# EAGLE design zumo_uni_spi_01 (EAGLE 9.5.2)
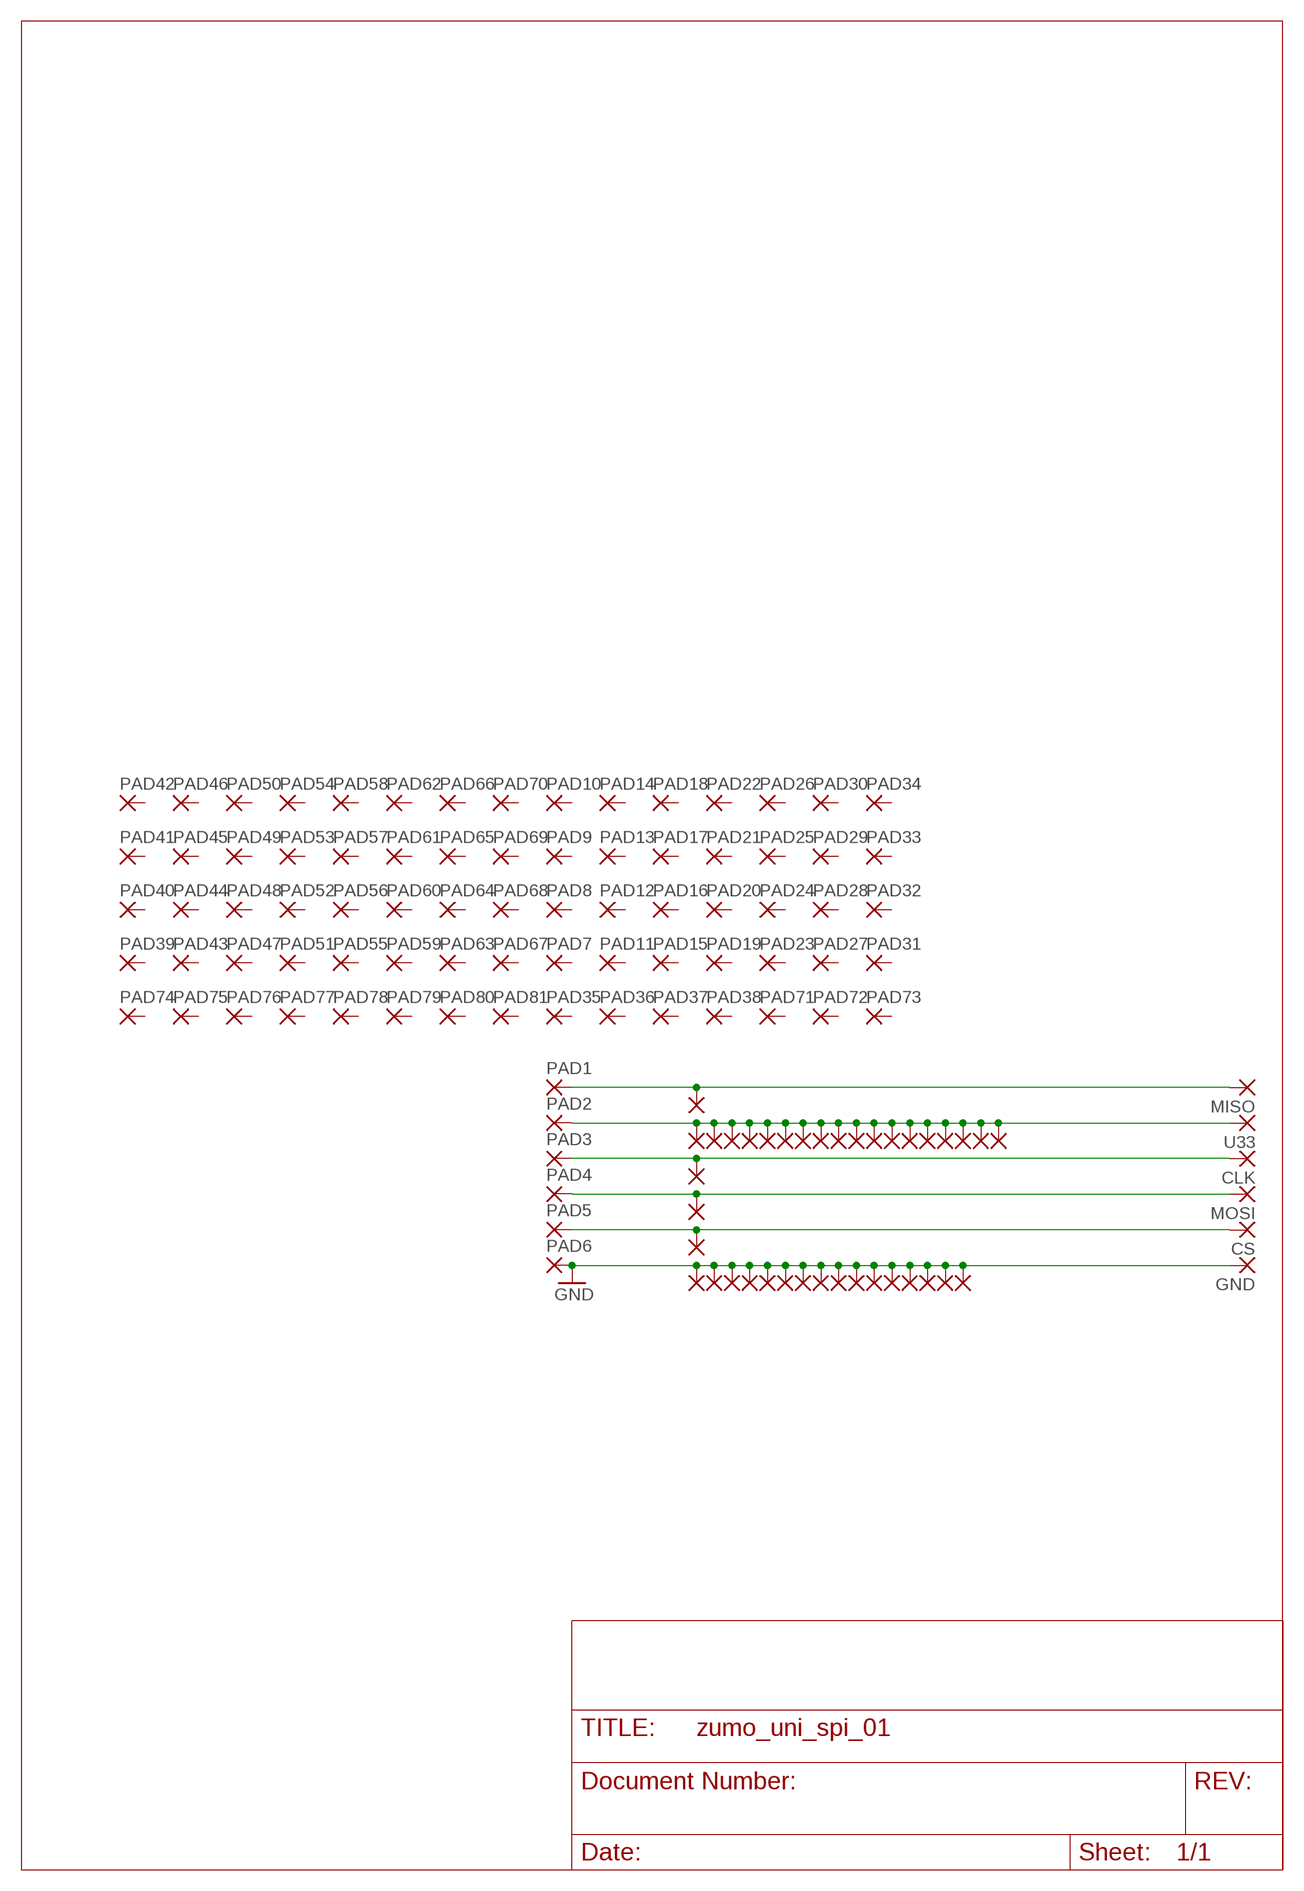
[diagram p0: schematic, sheet 1]

## Parts
CLK  1,6/0,9  [1,6/0,9]
CS  1,6/0,9  [1,6/0,9]
GND  1,6/0,9  [1,6/0,9]
MISO  1,6/0,9  [1,6/0,9]
MISO1  1,6/0,9  [1,6/0,9]
MISO2  1,6/0,9  [1,6/0,9]
MISO3  1,6/0,9  [1,6/0,9]
MISO4  1,6/0,9  [1,6/0,9]
MISO5  1,6/0,9  [1,6/0,9]
MISO6  1,6/0,9  [1,6/0,9]
MISO7  1,6/0,9  [1,6/0,9]
MISO8  1,6/0,9  [1,6/0,9]
MISO9  1,6/0,9  [1,6/0,9]
MISO10  1,6/0,9  [1,6/0,9]
MISO11  1,6/0,9  [1,6/0,9]
MISO12  1,6/0,9  [1,6/0,9]
MISO13  1,6/0,9  [1,6/0,9]
MISO14  1,6/0,9  [1,6/0,9]
MISO15  1,6/0,9  [1,6/0,9]
MISO16  1,6/0,9  [1,6/0,9]
MISO17  1,6/0,9  [1,6/0,9]
MISO18  1,6/0,9  [1,6/0,9]
MISO19  1,6/0,9  [1,6/0,9]
MISO20  1,6/0,9  [1,6/0,9]
MISO21  1,6/0,9  [1,6/0,9]
MISO22  1,6/0,9  [1,6/0,9]
MISO23  1,6/0,9  [1,6/0,9]
MISO24  1,6/0,9  [1,6/0,9]
MISO25  1,6/0,9  [1,6/0,9]
MISO26  1,6/0,9  [1,6/0,9]
MISO27  1,6/0,9  [1,6/0,9]
MISO28  1,6/0,9  [1,6/0,9]
MISO29  1,6/0,9  [1,6/0,9]
MISO30  1,6/0,9  [1,6/0,9]
MISO31  1,6/0,9  [1,6/0,9]
MISO32  1,6/0,9  [1,6/0,9]
MISO33  1,6/0,9  [1,6/0,9]
MISO34  1,6/0,9  [1,6/0,9]
MISO35  1,6/0,9  [1,6/0,9]
MISO36  1,6/0,9  [1,6/0,9]
MISO37  1,6/0,9  [1,6/0,9]
MISO38  1,6/0,9  [1,6/0,9]
MOSI  1,6/0,9  [1,6/0,9]
PAD1  SMD2  [SMD1,27-2,54]
PAD2  SMD2  [SMD1,27-2,54]
PAD3  SMD2  [SMD1,27-2,54]
PAD4  SMD2  [SMD1,27-2,54]
PAD5  SMD2  [SMD1,27-2,54]
PAD6  SMD2  [SMD1,27-2,54]
PAD7  1,6/0,9  [1,6/0,9]
PAD8  1,6/0,9  [1,6/0,9]
PAD9  1,6/0,9  [1,6/0,9]
PAD10  1,6/0,9  [1,6/0,9]
PAD11  1,6/0,9  [1,6/0,9]
PAD12  1,6/0,9  [1,6/0,9]
PAD13  1,6/0,9  [1,6/0,9]
PAD14  1,6/0,9  [1,6/0,9]
PAD15  1,6/0,9  [1,6/0,9]
PAD16  1,6/0,9  [1,6/0,9]
PAD17  1,6/0,9  [1,6/0,9]
PAD18  1,6/0,9  [1,6/0,9]
PAD19  1,6/0,9  [1,6/0,9]
PAD20  1,6/0,9  [1,6/0,9]
PAD21  1,6/0,9  [1,6/0,9]
PAD22  1,6/0,9  [1,6/0,9]
PAD23  1,6/0,9  [1,6/0,9]
PAD24  1,6/0,9  [1,6/0,9]
PAD25  1,6/0,9  [1,6/0,9]
PAD26  1,6/0,9  [1,6/0,9]
PAD27  1,6/0,9  [1,6/0,9]
PAD28  1,6/0,9  [1,6/0,9]
PAD29  1,6/0,9  [1,6/0,9]
PAD30  1,6/0,9  [1,6/0,9]
PAD31  1,6/0,9  [1,6/0,9]
PAD32  1,6/0,9  [1,6/0,9]
PAD33  1,6/0,9  [1,6/0,9]
PAD34  1,6/0,9  [1,6/0,9]
PAD35  1,6/0,9  [1,6/0,9]
PAD36  1,6/0,9  [1,6/0,9]
PAD37  1,6/0,9  [1,6/0,9]
PAD38  1,6/0,9  [1,6/0,9]
PAD39  1,6/0,9  [1,6/0,9]
PAD40  1,6/0,9  [1,6/0,9]
PAD41  1,6/0,9  [1,6/0,9]
PAD42  1,6/0,9  [1,6/0,9]
PAD43  1,6/0,9  [1,6/0,9]
PAD44  1,6/0,9  [1,6/0,9]
PAD45  1,6/0,9  [1,6/0,9]
PAD46  1,6/0,9  [1,6/0,9]
PAD47  1,6/0,9  [1,6/0,9]
PAD48  1,6/0,9  [1,6/0,9]
PAD49  1,6/0,9  [1,6/0,9]
PAD50  1,6/0,9  [1,6/0,9]
PAD51  1,6/0,9  [1,6/0,9]
PAD52  1,6/0,9  [1,6/0,9]
PAD53  1,6/0,9  [1,6/0,9]
PAD54  1,6/0,9  [1,6/0,9]
PAD55  1,6/0,9  [1,6/0,9]
PAD56  1,6/0,9  [1,6/0,9]
PAD57  1,6/0,9  [1,6/0,9]
PAD58  1,6/0,9  [1,6/0,9]
PAD59  1,6/0,9  [1,6/0,9]
PAD60  1,6/0,9  [1,6/0,9]
PAD61  1,6/0,9  [1,6/0,9]
PAD62  1,6/0,9  [1,6/0,9]
PAD63  1,6/0,9  [1,6/0,9]
PAD64  1,6/0,9  [1,6/0,9]
PAD65  1,6/0,9  [1,6/0,9]
PAD66  1,6/0,9  [1,6/0,9]
PAD67  1,6/0,9  [1,6/0,9]
PAD68  1,6/0,9  [1,6/0,9]
PAD69  1,6/0,9  [1,6/0,9]
PAD70  1,6/0,9  [1,6/0,9]
PAD71  1,6/0,9  [1,6/0,9]
PAD72  1,6/0,9  [1,6/0,9]
PAD73  1,6/0,9  [1,6/0,9]
PAD74  1,6/0,9  [1,6/0,9]
PAD75  1,6/0,9  [1,6/0,9]
PAD76  1,6/0,9  [1,6/0,9]
PAD77  1,6/0,9  [1,6/0,9]
PAD78  1,6/0,9  [1,6/0,9]
PAD79  1,6/0,9  [1,6/0,9]
PAD80  1,6/0,9  [1,6/0,9]
PAD81  1,6/0,9  [1,6/0,9]
U33  1,6/0,9  [1,6/0,9]

## Nets
GND [gnd]: GND.1(P) MISO5.1(P) MISO6.1(P) MISO7.1(P) MISO8.1(P) MISO9.1(P) MISO10.1(P) MISO11.1(P) MISO12.1(P) MISO13.1(P) MISO14.1(P) MISO15.1(P) MISO16.1(P) MISO17.1(P) MISO18.1(P) MISO19.1(P) MISO20.1(P) PAD6.1(P)
SPI_CLK: CLK.1(P) MISO3.1(P) PAD3.1(P)
SPI_CS: CS.1(P) MISO1.1(P) PAD5.1(P)
SPI_MISO: MISO21.1(P) MISO.1(P) PAD1.1(P)
SPI_MOSI: MISO2.1(P) MOSI.1(P) PAD4.1(P)
U3.3 [power]: MISO4.1(P) MISO22.1(P) MISO23.1(P) MISO24.1(P) MISO25.1(P) MISO26.1(P) MISO27.1(P) MISO28.1(P) MISO29.1(P) MISO30.1(P) MISO31.1(P) MISO32.1(P) MISO33.1(P) MISO34.1(P) MISO35.1(P) MISO36.1(P) MISO37.1(P) MISO38.1(P) PAD2.1(P) U33.1(P)
Unconnected: PAD7.1(P) PAD8.1(P) PAD9.1(P) PAD10.1(P) PAD11.1(P) PAD12.1(P) PAD13.1(P) PAD14.1(P) PAD15.1(P) PAD16.1(P) PAD17.1(P) PAD18.1(P) PAD19.1(P) PAD20.1(P) PAD21.1(P) PAD22.1(P) PAD23.1(P) PAD24.1(P) PAD25.1(P) PAD26.1(P) PAD27.1(P) PAD28.1(P) PAD29.1(P) PAD30.1(P) PAD31.1(P) PAD32.1(P) PAD33.1(P) PAD34.1(P) PAD35.1(P) PAD36.1(P) PAD37.1(P) PAD38.1(P) PAD39.1(P) PAD40.1(P) PAD41.1(P) PAD42.1(P) PAD43.1(P) PAD44.1(P) PAD45.1(P) PAD46.1(P) PAD47.1(P) PAD48.1(P) PAD49.1(P) PAD50.1(P) PAD51.1(P) PAD52.1(P) PAD53.1(P) PAD54.1(P) PAD55.1(P) PAD56.1(P) PAD57.1(P) PAD58.1(P) PAD59.1(P) PAD60.1(P) PAD61.1(P) PAD62.1(P) PAD63.1(P) PAD64.1(P) PAD65.1(P) PAD66.1(P) PAD67.1(P) PAD68.1(P) PAD69.1(P) PAD70.1(P) PAD71.1(P) PAD72.1(P) PAD73.1(P) PAD74.1(P) PAD75.1(P) PAD76.1(P) PAD77.1(P) PAD78.1(P) PAD79.1(P) PAD80.1(P) PAD81.1(P)

## Library data of the parts
CLK CS GND MISO MISO1-MISO38 MOSI PAD7-PAD81 U33 = wirepad:1,6/0,9: THROUGH-HOLE PAD
PAD1-PAD6 = wirepad:SMD2: SMD PAD

## Net classes
1 gnd: width 0.381 mm, drill 0.381 mm
2 power: width 0.381 mm, drill 0.381 mm

## Board
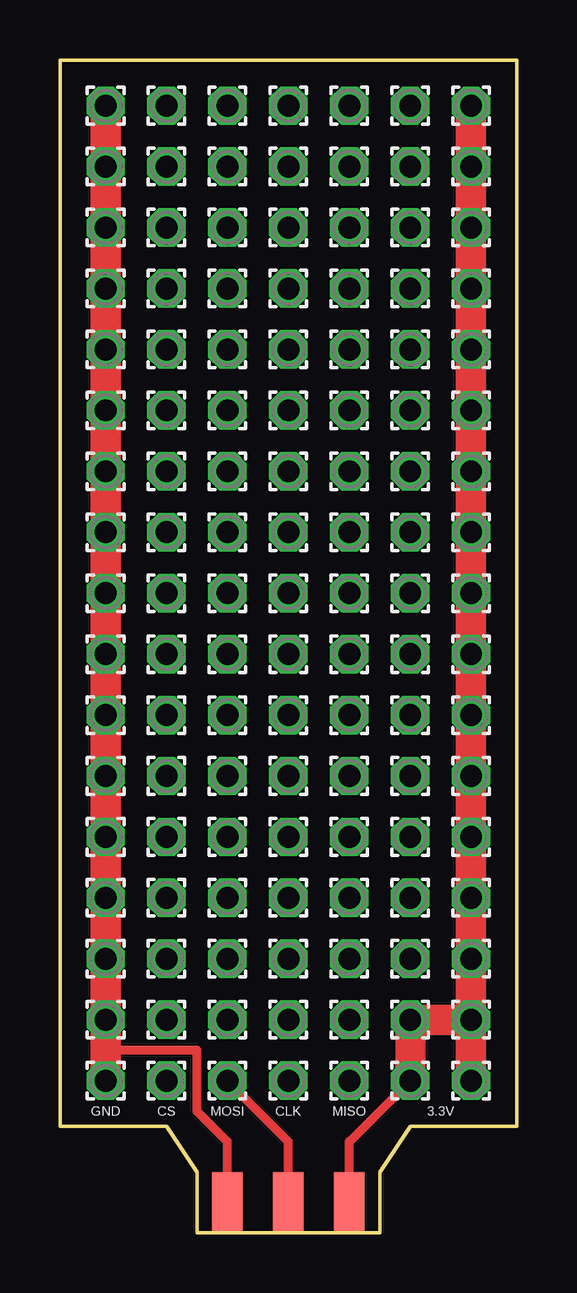
[diagram p1: board, top side]
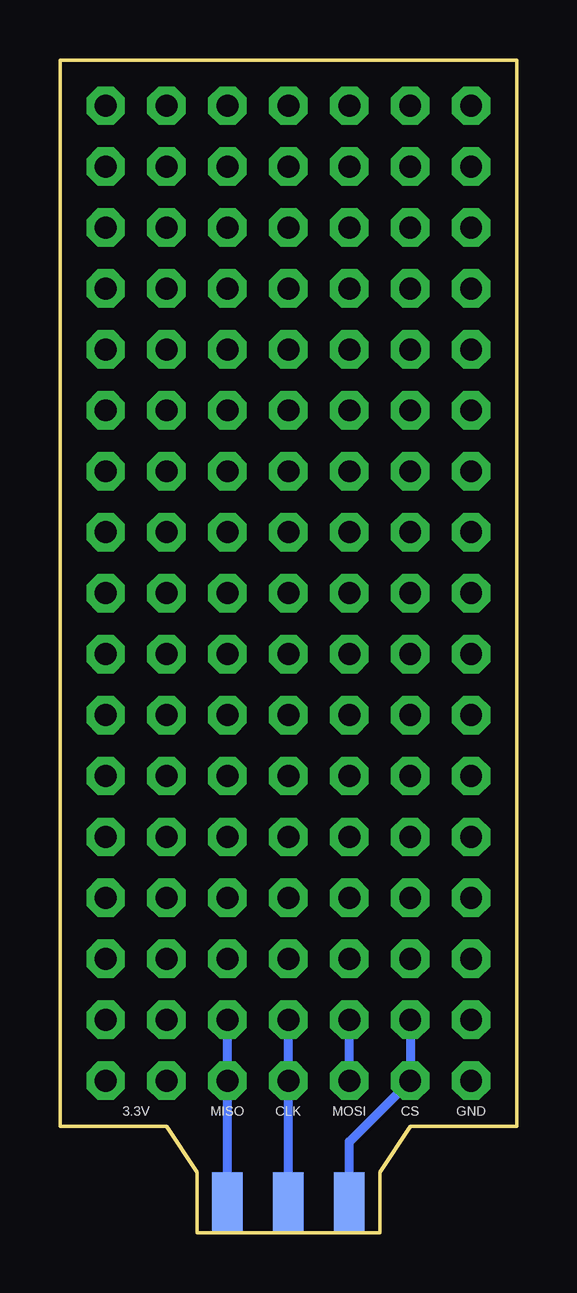
[diagram p2: board, bottom side, seen from below]

Size 19.05 x 48.9 mm. Coordinates in mm from the lower left corner, seen from the top.
Outline: 5.71,0 5.71,2.54 4.45,4.45 0,4.45 0,48.9 19.05,48.9 19.05,4.45 14.61,4.45 13.34,2.54 13.34,0 5.71,0
Copper layers (1*16): Top 0.035mm / dielectric 1.5mm / Bottom 0.035mm
Design rules "default": minimum track width 6mil, minimum drill 0.35mm, track to track 6mil, track to pad 6mil, pad to pad 6mil, via to via 6mil, smd to smd 6mil, copper to edge 40mil, drill to drill 6mil, minimum pad ring 10mil, minimum via ring 8mil, stop-mask expansion 4mil, vias tented up to drill 0mil, thermal gap 10mil

### Footprints (pad centres in the part's own frame; a part is rotated, then mirrored left to right if it is on the bottom)
1,6/0,9 = drill 0.914 pad 1.6 octagon: 1 0,0
SMD1,27-2,54 = smd 1.27 x 2.54: 1 0,0

### Placement (x,y rotation side)
CLK  9.53,6.35 0 top
CS  4.45,6.35 0 top
GND  1.91,6.35 0 top
MISO  12.06,6.35 0 top
MISO1  4.45,8.89 0 top
MISO2  6.99,8.89 0 top
MISO3  9.53,8.89 0 top
MISO4  17.14,8.89 0 top
MISO5  1.91,21.59 0 top
MISO6  1.91,26.67 0 top
MISO7  1.91,16.51 0 top
MISO8  1.91,24.13 0 top
MISO9  1.91,31.75 0 top
MISO10  1.91,29.21 0 top
MISO11  1.91,34.29 0 top
MISO12  1.91,39.37 0 top
MISO13  1.91,44.45 0 top
MISO14  1.91,41.91 0 top
MISO15  1.91,46.99 0 top
MISO16  1.91,19.05 0 top
MISO17  1.91,13.97 0 top
MISO18  1.91,11.43 0 top
MISO19  1.91,8.89 0 top
MISO20  1.91,36.83 0 top
MISO21  12.06,8.89 0 top
MISO22  17.14,11.43 0 top
MISO23  17.14,13.97 0 top
MISO24  17.14,16.51 0 top
MISO25  17.14,19.05 0 top
MISO26  17.14,21.59 0 top
MISO27  17.14,24.13 0 top
MISO28  17.14,26.67 0 top
MISO29  17.14,29.21 0 top
MISO30  17.14,31.75 0 top
MISO31  17.14,34.29 0 top
MISO32  17.14,36.83 0 top
MISO33  17.14,39.37 0 top
MISO34  17.14,41.91 0 top
MISO35  17.14,44.45 0 top
MISO36  17.14,46.99 0 top
MISO37  14.61,6.35 0 top
MISO38  14.61,8.89 0 top
MOSI  6.99,6.35 0 top
PAD1  12.06,1.27 0 bottom
PAD2  12.06,1.27 0 top
PAD3  9.53,1.27 0 bottom
PAD4  9.53,1.27 0 top
PAD5  6.99,1.27 0 bottom
PAD6  6.99,1.27 0 top
PAD7  4.45,11.43 0 top
PAD8  6.99,11.43 0 top
PAD9  9.53,11.43 0 top
PAD10  12.06,11.43 0 top
PAD11  12.06,13.97 0 top
PAD12  4.45,13.97 0 top
PAD13  6.99,13.97 0 top
PAD14  9.53,13.97 0 top
PAD15  4.45,16.51 0 top
PAD16  6.99,16.51 0 top
PAD17  9.53,16.51 0 top
PAD18  12.06,16.51 0 top
PAD19  4.45,19.05 0 top
PAD20  6.99,19.05 0 top
PAD21  12.06,19.05 0 top
PAD22  9.53,19.05 0 top
PAD23  4.45,21.59 0 top
PAD24  6.99,21.59 0 top
PAD25  9.53,21.59 0 top
PAD26  12.06,21.59 0 top
PAD27  4.45,24.13 0 top
PAD28  6.99,24.13 0 top
PAD29  9.53,24.13 0 top
PAD30  12.06,24.13 0 top
PAD31  4.45,26.67 0 top
PAD32  6.99,26.67 0 top
PAD33  9.53,26.67 0 top
PAD34  12.06,26.67 0 top
PAD35  14.61,11.43 0 top
PAD36  14.61,16.51 0 top
PAD37  14.61,19.05 0 top
PAD38  14.61,13.97 0 top
PAD39  4.45,29.21 0 top
PAD40  6.99,29.21 0 top
PAD41  9.53,29.21 0 top
PAD42  12.06,29.21 0 top
PAD43  4.45,31.75 0 top
PAD44  6.99,31.75 0 top
PAD45  9.53,31.75 0 top
PAD46  12.06,31.75 0 top
PAD47  4.45,34.29 0 top
PAD48  6.99,34.29 0 top
PAD49  9.53,34.29 0 top
PAD50  12.06,34.29 0 top
PAD51  4.45,36.83 0 top
PAD52  6.99,36.83 0 top
PAD53  9.53,36.83 0 top
PAD54  12.06,36.83 0 top
PAD55  4.45,39.37 0 top
PAD56  6.99,39.37 0 top
PAD57  12.06,39.37 0 top
PAD58  4.45,41.91 0 top
PAD59  9.53,39.37 0 top
PAD60  6.99,41.91 0 top
PAD61  4.45,46.99 0 top
PAD62  6.99,46.99 0 top
PAD63  9.53,41.91 0 top
PAD64  4.45,44.45 0 top
PAD65  12.06,44.45 0 top
PAD66  9.53,46.99 0 top
PAD67  12.06,41.91 0 top
PAD68  6.99,44.45 0 top
PAD69  9.53,44.45 0 top
PAD70  12.06,46.99 0 top
PAD71  14.61,26.67 0 top
PAD72  14.61,21.59 0 top
PAD73  14.61,34.29 0 top
PAD74  14.61,29.21 0 top
PAD75  14.61,24.13 0 top
PAD76  14.61,39.37 0 top
PAD77  14.61,36.83 0 top
PAD78  14.61,31.75 0 top
PAD79  14.61,41.91 0 top
PAD80  14.61,46.99 0 top
PAD81  14.61,44.45 0 top
U33  17.14,6.35 0 top

### Tracks (layer width: path | path; a pad name or v marks a point on that pad's centre or on a via)
GND
  Top 0.381: PAD6.1 6.99,3.81 5.71,5.08 5.71,7.62 1.91,7.62
  Top 1.27: MISO15.1 MISO13.1 MISO14.1 MISO12.1 MISO20.1 MISO11.1 MISO9.1 MISO10.1 MISO6.1 MISO8.1 MISO5.1 MISO16.1 MISO7.1 MISO17.1 MISO18.1 MISO19.1 1.91,7.62 GND.1
SPI_CLK
  Bottom 0.381: PAD3.1 CLK.1 MISO3.1
SPI_CS
  Bottom 0.381: MISO1.1 CS.1 6.99,3.81 PAD5.1
SPI_MISO
  Bottom 0.381: PAD1.1 MISO.1 MISO21.1
SPI_MOSI
  Top 0.381: PAD4.1 9.53,3.81 MOSI.1
  Bottom 0.381: MOSI.1 MISO2.1
U3.3
  Top 0.381: PAD2.1 12.06,3.81 MISO37.1
  Top 1.27: MISO37.1 MISO38.1 MISO4.1 | MISO4.1 U33.1 | MISO4.1 MISO22.1 MISO23.1 MISO24.1 MISO25.1 MISO26.1 MISO27.1 MISO28.1 MISO29.1 MISO30.1 MISO31.1 MISO32.1 MISO33.1 MISO34.1 MISO35.1 MISO36.1

### Text on the board
tNames: GND | CS | MOSI | CLK | MISO | 3.3V
bNames: GND | CS | MOSI | CLK | MISO | 3.3V